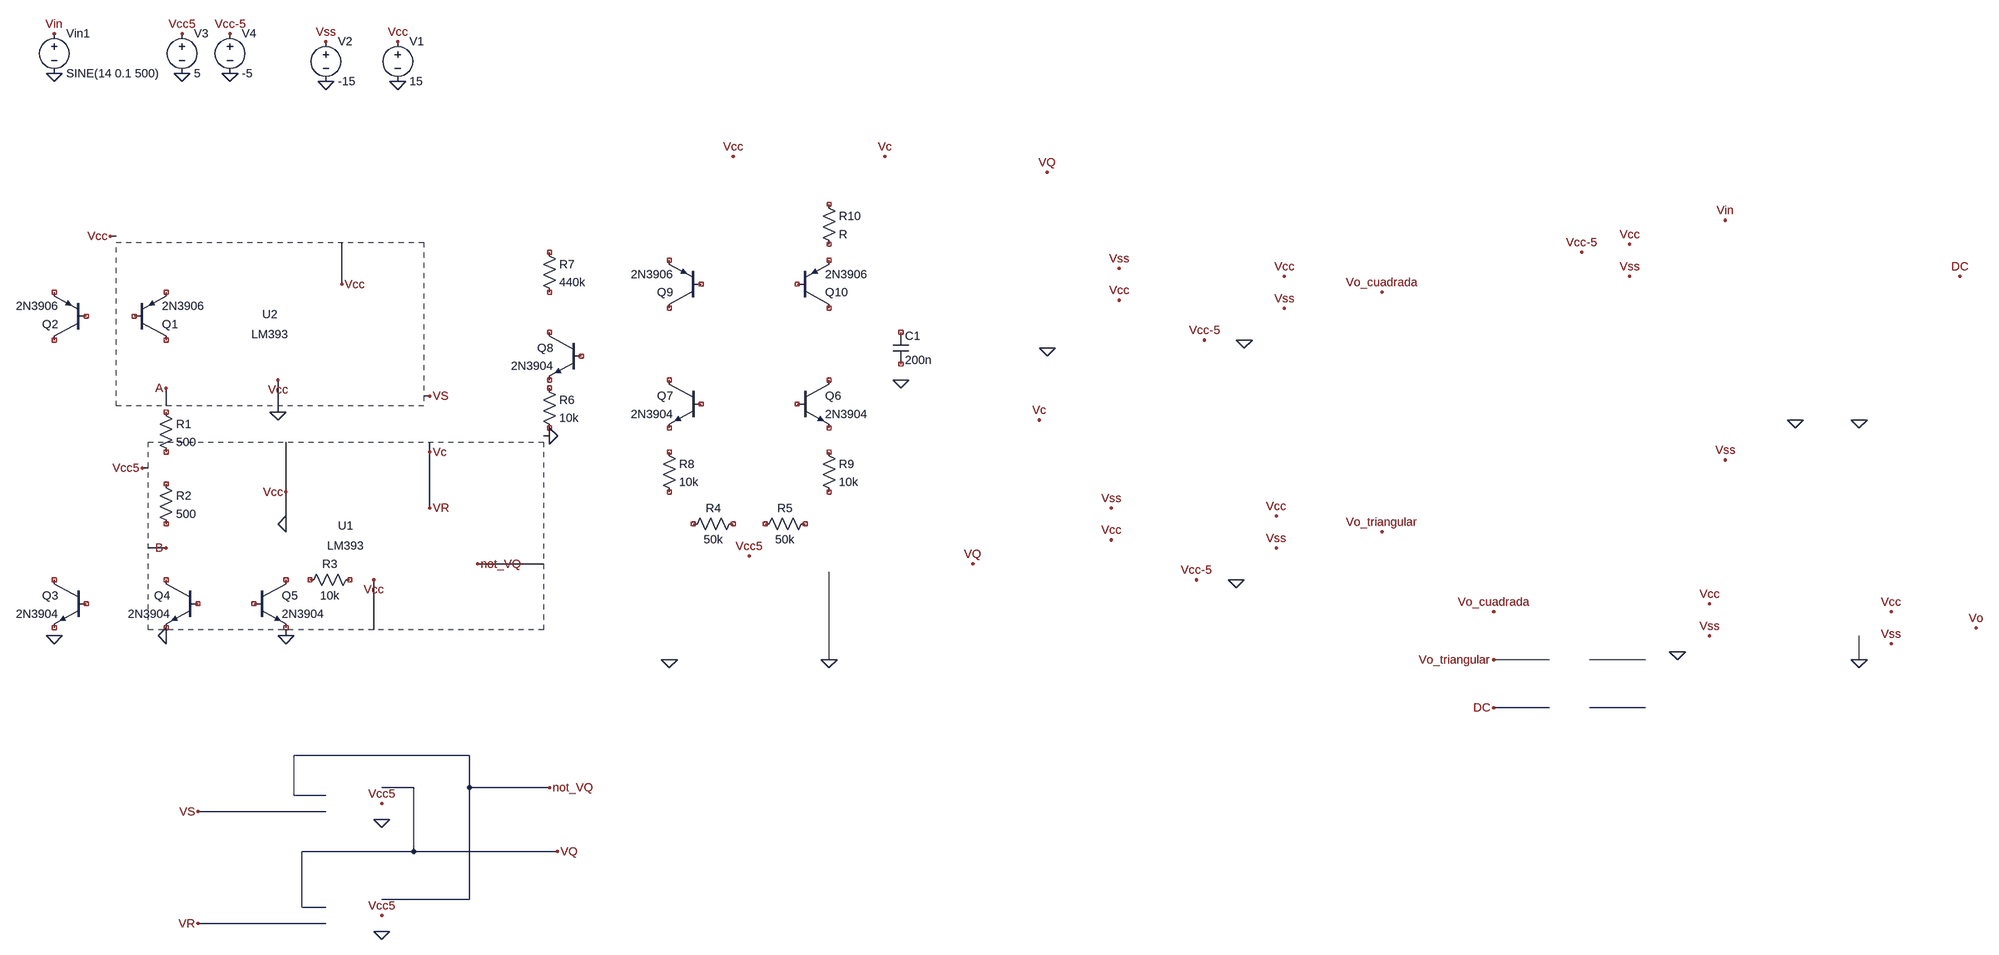
[diagram p0: schematic Draft2.asc]
Draft2.asc, the LTspice schematic file:
WIRE -80 928 -80 752
WIRE 1680 928 1568 928
WIRE 1872 928 1760 928
WIRE 2320 928 2320 880
WIRE 1680 1024 1568 1024
WIRE 1872 1024 1760 1024
WIRE -800 1120 -1152 1120
WIRE -912 1184 -976 1184
WIRE -800 1184 -800 1120
WIRE -640 1184 -800 1184
WIRE -1152 1200 -1152 1120
WIRE -1088 1200 -1152 1200
WIRE -1088 1232 -1344 1232
WIRE -912 1312 -912 1184
WIRE -912 1312 -1136 1312
WIRE -624 1312 -912 1312
WIRE -800 1408 -800 1184
WIRE -800 1408 -976 1408
WIRE -1136 1424 -1136 1312
WIRE -1088 1424 -1136 1424
WIRE -1088 1456 -1344 1456
FLAG -1168 880 0
FLAG -1408 880 0
FLAG -1632 880 0
FLAG -640 480 0
FLAG 64 368 0
FLAG -272 -80 Vcc
FLAG -240 720 Vcc5
FLAG -80 928 0
FLAG -400 928 0
FLAG -1520 80 Vcc
FLAG -992 768 Vcc
FLAG -880 400 VS
FLAG -880 624 VR
FLAG -1456 544 Vcc5
FLAG -880 512 Vc
FLAG 208 736 VQ
FLAG -784 736 not_VQ
FLAG 32 -80 Vc
FLAG -944 -640 Vcc
FLAG -1088 -640 Vss
FLAG -1088 -560 0
FLAG -944 -560 0
FLAG -1376 -656 Vcc5
FLAG -1376 -576 0
FLAG -1280 -576 0
FLAG -1280 -656 Vcc-5
FLAG -1632 -656 Vin
FLAG -1632 -576 0
FLAG -1184 368 Vcc
FLAG -1184 432 0
FLAG -1168 592 Vcc
FLAG -1168 656 0
FLAG -1056 176 Vcc
FLAG -1408 384 A
FLAG -1408 704 B
FLAG 576 208 Vcc
FLAG 576 144 Vss
FLAG 432 304 0
FLAG 880 288 Vcc-5
FLAG 960 288 0
FLAG 432 -48 VQ
FLAG 1344 192 Vo_cuadrada
FLAG 2624 864 Vo
FLAG 1936 912 0
FLAG 2320 928 0
FLAG 1040 160 Vcc
FLAG 1040 224 Vss
FLAG 560 688 Vcc
FLAG 560 624 Vss
FLAG 864 768 Vcc-5
FLAG 944 768 0
FLAG 416 448 Vc
FLAG 1344 672 Vo_triangular
FLAG 1024 640 Vcc
FLAG 1024 704 Vss
FLAG 2384 832 Vcc
FLAG 2384 896 Vss
FLAG 2000 816 Vcc
FLAG 2000 880 Vss
FLAG -1344 1232 VS
FLAG -1344 1456 VR
FLAG -976 1440 Vcc5
FLAG -976 1472 0
FLAG -976 1248 0
FLAG -976 1216 Vcc5
FLAG -624 1312 VQ
FLAG -640 1184 not_VQ
FLAG 1568 832 Vo_cuadrada
FLAG 1568 928 Vo_triangular
FLAG 1568 1024 DC
FLAG 1744 112 Vcc-5
FLAG 2192 448 0
FLAG 2592 160 DC
FLAG 1840 96 Vcc
FLAG 1840 160 Vss
FLAG 2032 528 Vss
FLAG 2032 48 Vin
FLAG 2320 448 0
SYMBOL pnp -1472 288 M180
SYMATTR InstName Q1
SYMATTR Value 2N3906
SYMBOL pnp -1568 288 R180
SYMATTR InstName Q2
SYMATTR Value 2N3906
SYMBOL npn -1568 768 M0
SYMATTR InstName Q3
SYMATTR Value 2N3904
SYMBOL res -1424 416 R0
SYMATTR InstName R1
SYMATTR Value 500
SYMBOL res -1424 560 R0
SYMATTR InstName R2
SYMATTR Value 500
SYMBOL npn -1344 768 M0
SYMATTR InstName Q4
SYMATTR Value 2N3904
SYMBOL npn -1232 768 R0
SYMATTR InstName Q5
SYMATTR Value 2N3904
SYMBOL res -1024 752 R90
WINDOW 0 0 56 VBottom 2
WINDOW 3 32 56 VTop 2
SYMATTR InstName R3
SYMATTR Value 10k
SYMBOL res -256 640 R90
WINDOW 0 0 56 VBottom 2
WINDOW 3 32 56 VTop 2
SYMATTR InstName R4
SYMATTR Value 50k
SYMBOL res -112 640 R90
WINDOW 0 0 56 VBottom 2
WINDOW 3 32 56 VTop 2
SYMATTR InstName R5
SYMATTR Value 50k
SYMBOL npn -144 368 R0
SYMATTR InstName Q6
SYMATTR Value 2N3904
SYMBOL npn -336 368 M0
SYMATTR InstName Q7
SYMATTR Value 2N3904
SYMBOL npn -576 272 M0
SYMATTR InstName Q8
SYMATTR Value 2N3904
SYMBOL res -656 368 R0
SYMATTR InstName R6
SYMATTR Value 10k
SYMBOL res -656 96 R0
SYMATTR InstName R7
SYMATTR Value 440k
SYMBOL cap 48 272 R0
SYMATTR InstName C1
SYMATTR Value 200n
SYMBOL pnp -336 224 R180
SYMATTR InstName Q9
SYMATTR Value 2N3906
SYMBOL pnp -144 224 M180
SYMATTR InstName Q10
SYMATTR Value 2N3906
SYMBOL voltage -944 -656 R0
WINDOW 123 0 0 Left 2
WINDOW 39 0 0 Left 2
SYMATTR InstName V1
SYMATTR Value 15
SYMBOL voltage -1088 -656 R0
WINDOW 123 0 0 Left 2
WINDOW 39 0 0 Left 2
SYMATTR InstName V2
SYMATTR Value -15
SYMBOL voltage -1376 -672 R0
WINDOW 123 0 0 Left 2
WINDOW 39 0 0 Left 2
SYMATTR InstName V3
SYMATTR Value 5
SYMBOL voltage -1280 -672 R0
WINDOW 123 0 0 Left 2
WINDOW 39 0 0 Left 2
SYMATTR InstName V4
SYMATTR Value -5
SYMBOL voltage -1632 -672 R0
WINDOW 123 0 0 Left 2
WINDOW 39 0 0 Left 2
SYMATTR InstName Vin1
SYMATTR Value SINE(14 0.1 500)
SYMBOL opamp2 -1168 560 R0
SYMATTR InstName U1
SYMATTR Value LM393
SYMBOL opamp2 -1184 336 R0
SYMATTR InstName U2
SYMATTR Value LM393
SYMBOL res -416 496 R0
SYMATTR InstName R8
SYMATTR Value 10k
SYMBOL res -96 496 R0
SYMATTR InstName R9
SYMATTR Value 10k
SYMBOL res -96 0 R0
SYMATTR InstName R10
SYMATTR V

The netlist it stands for:
* Draft2.asc
Q1 NC_01 NC_02 NC_03 0 2N3906
Q2 NC_04 NC_05 NC_06 0 2N3906
Q3 NC_07 NC_08 NC_09 0 2N3904
R1 NC_10 NC_11 500
R2 NC_12 NC_13 500
Q4 NC_14 NC_15 NC_16 0 2N3904
Q5 NC_17 NC_18 NC_19 0 2N3904
R3 NC_20 NC_21 10k
R4 NC_22 NC_23 50k
R5 NC_24 NC_25 50k
Q6 NC_26 NC_27 NC_28 0 2N3904
Q7 NC_29 NC_30 NC_31 0 2N3904
Q8 NC_32 NC_33 NC_34 0 2N3904
R6 NC_35 NC_36 10k
R7 NC_37 NC_38 440k
C1 NC_39 NC_40 200n
Q9 NC_41 NC_42 NC_43 0 2N3906
Q10 NC_44 NC_45 NC_46 0 2N3906
V1 Vcc 0 15
V2 Vss 0 -15
V3 Vcc5 0 5
V4 Vcc-5 0 -5
Vin1 Vin 0 SINE(14 0.1 500)
* U1: LM393 (symbol opamp2 not available, pin order unknown); nets seen at it: 0, B, not_VQ, Vc, Vcc, Vcc5, VR
* U2: LM393 (symbol opamp2 not available, pin order unknown); nets seen at it: 0, A, Vcc, VS
R8 NC_47 NC_48 10k
R9 NC_49 NC_50 10k
R10 NC_51 NC_52 R
.model NPN NPN
.model PNP PNP
.lib standard.bjt
.backanno
.end